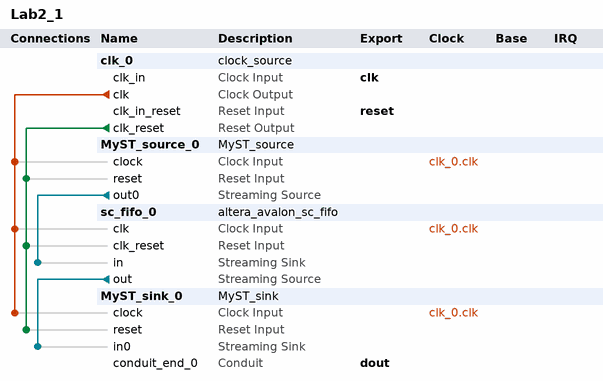
[diagram p0: system contents]
# Platform Designer (Qsys) system Lab2_1, Cyclone IV E EP4CE6E22C8
# Parameters at their usual value, and those the tool derives, are not listed.
package require -exact qsys 16.1
create_system Lab2_1
set_project_property DEVICE_FAMILY {Cyclone IV E}
set_project_property DEVICE EP4CE6E22C8

add_instance clk_0 clock_source 16.1
set_instance_parameter_value clk_0 clockFrequency 50000000
set_instance_parameter_value clk_0 resetSynchronousEdges DEASSERT

add_instance MyST_source_0 MyST_source 1.0

add_instance sc_fifo_0 altera_avalon_sc_fifo 16.1
set_instance_parameter_value sc_fifo_0 BITS_PER_SYMBOL 4
set_instance_parameter_value sc_fifo_0 CHANNEL_WIDTH 0
set_instance_parameter_value sc_fifo_0 ERROR_WIDTH 0
set_instance_parameter_value sc_fifo_0 FIFO_DEPTH 16
set_instance_parameter_value sc_fifo_0 USE_FILL_LEVEL 0
set_instance_parameter_value sc_fifo_0 USE_MEMORY_BLOCKS 1
set_instance_parameter_value sc_fifo_0 USE_STORE_FORWARD 0

add_instance MyST_sink_0 MyST_sink 1.0

# connections
add_connection clk_0.clk MyST_sink_0.clock clock
add_connection clk_0.clk MyST_source_0.clock clock
add_connection clk_0.clk sc_fifo_0.clk clock
add_connection clk_0.clk_reset MyST_sink_0.reset reset
add_connection clk_0.clk_reset MyST_source_0.reset reset
add_connection clk_0.clk_reset sc_fifo_0.clk_reset reset
add_connection MyST_source_0.out0 sc_fifo_0.in avalon_streaming
add_connection sc_fifo_0.out MyST_sink_0.in0 avalon_streaming

# exported interfaces
add_interface clk clock sink
set_interface_property clk EXPORT_OF clk_0.clk_in
add_interface dout conduit end
set_interface_property dout EXPORT_OF MyST_sink_0.conduit_end_0
add_interface reset reset sink
set_interface_property reset EXPORT_OF clk_0.clk_in_reset

set_interconnect_requirement {$system} qsys_mm.clockCrossingAdapter HANDSHAKE
set_interconnect_requirement {$system} qsys_mm.enableEccProtection FALSE
set_interconnect_requirement {$system} qsys_mm.insertDefaultSlave FALSE
set_interconnect_requirement {$system} qsys_mm.maxAdditionalLatency 1

save_system Lab2_1.qsys
